# EAGLE design sduino (EAGLE 7.4.0)
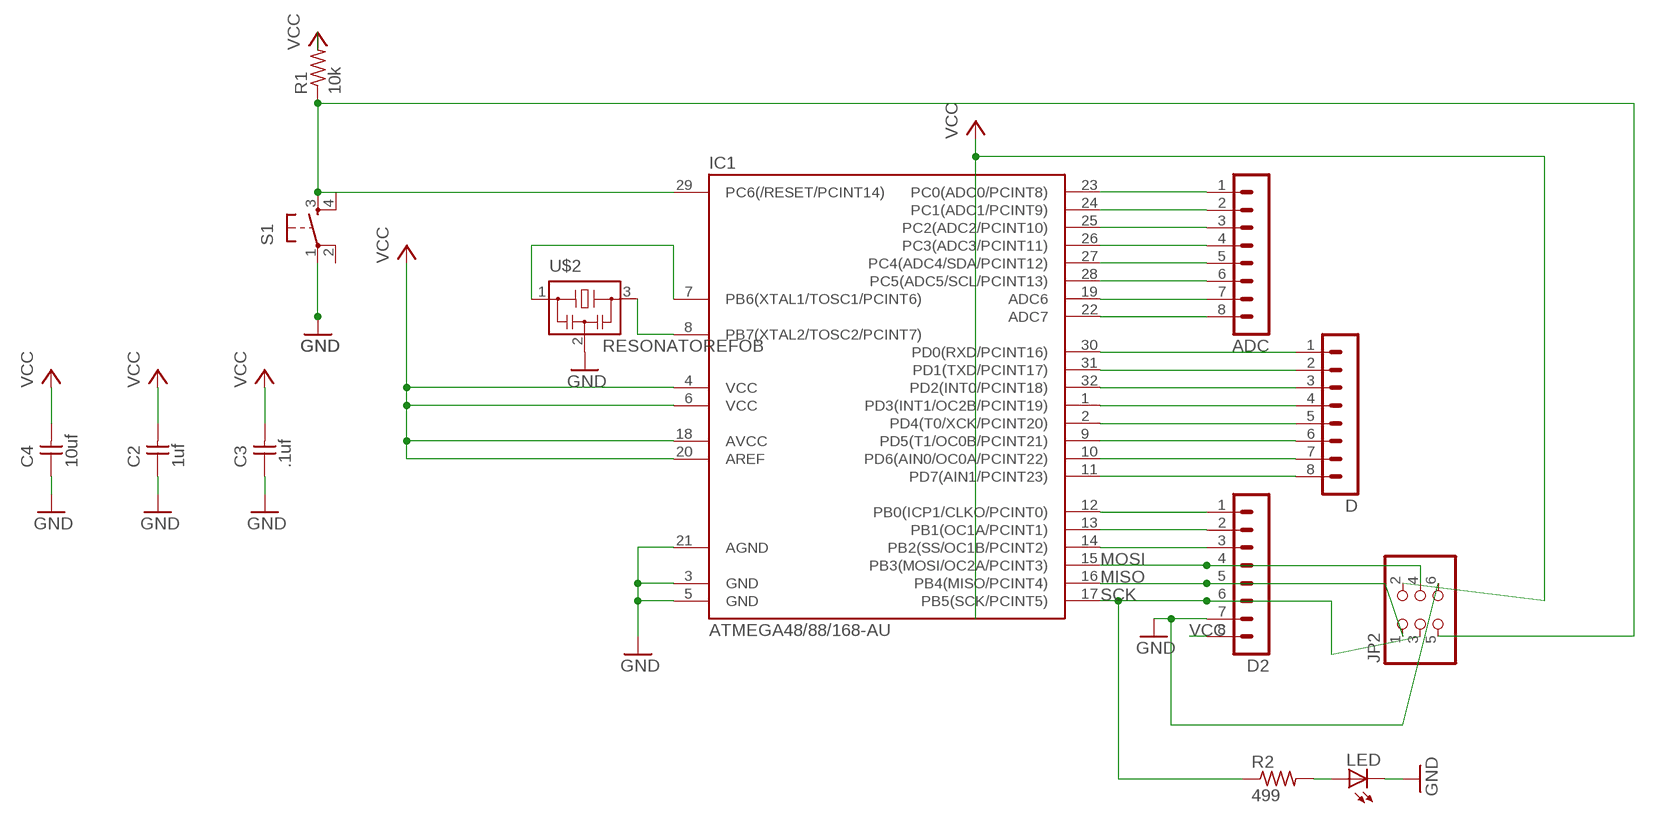
[diagram p0: schematic, sheet 1]

## Parts
ADC  MA08-1  [MA08-1]
C2  1uf  UNPOLARIZED_CAPACITOR1206  [1206]
C3  .1uf  UNPOLARIZED_CAPACITOR1206  [1206]
C4  10uf  UNPOLARIZED_CAPACITOR1206  [1206]
D  MA08-1  [MA08-1]
D2  MA08-1  [MA08-1]
IC1  ATMEGA48/88/168-AU  [TQFP32-08]
JP2  PINHD-2X3-SMD  [2X03SMD]
LED  LED1206  [1206]
R1  10k  RESISTOR1206  [1206]
R2  499  RESISTOR1206  [1206]
S1  6MM_SWITCH6MM_SWITCH  [6MM_SWITCH]
U$2  RESONATOREFOB  [EFOBM]

## Nets
GND: C2.1 C3.1 C4.1 D2.7 IC1.3(GND) IC1.5(GND) IC1.21(AGND) JP2.6 LED.2(C) S1.1(P) U$2.2
MISO: D2.5 IC1.16(PB4(MISO/PCINT4)) JP2.1
MOSI: D2.4 IC1.15(PB3(MOSI/OC2A/PCINT3)) JP2.4
N$1: IC1.7(PB6(XTAL1/TOSC1/PCINT6)) U$2.1
N$2: D2.1 IC1.12(PB0(ICP1/CLKO/PCINT0))
N$3: ADC.1 IC1.23(PC0(ADC0/PCINT8))
N$4: ADC.2 IC1.24(PC1(ADC1/PCINT9))
N$5: ADC.3 IC1.25(PC2(ADC2/PCINT10))
N$6: ADC.4 IC1.26(PC3(ADC3/PCINT11))
N$7: ADC.5 IC1.27(PC4(ADC4/SDA/PCINT12))
N$8: ADC.6 IC1.28(PC5(ADC5/SCL/PCINT13))
N$10: D.3 IC1.32(PD2(INT0/PCINT18))
N$11: D.4 IC1.1(PD3(INT1/OC2B/PCINT19))
N$12: D.5 IC1.2(PD4(T0/XCK/PCINT20))
N$13: D.6 IC1.9(PD5(T1/OC0B/PCINT21))
N$14: D.7 IC1.10(PD6(AIN0/OC0A/PCINT22))
N$15: D.8 IC1.11(PD7(AIN1/PCINT23))
N$16: IC1.8(PB7(XTAL2/TOSC2/PCINT7)) U$2.3
N$17: D2.2 IC1.13(PB1(OC1A/PCINT1))
N$18: D2.3 IC1.14(PB2(SS/OC1B/PCINT2))
N$21: ADC.7 IC1.19(ADC6)
N$22: ADC.8 IC1.22(ADC7)
N$23: LED.1(A) R2.2
RST: IC1.29(PC6(/RESET/PCINT14)) JP2.5 R1.1 S1.3(S)
RX: D.1 IC1.30(PD0(RXD/PCINT16))
SCK: D2.6 IC1.17(PB5(SCK/PCINT5)) JP2.3 R2.1
TX: D.2 IC1.31(PD1(TXD/PCINT17))
VCC: C2.2 C3.2 C4.2 D2.8 IC1.4(VCC) IC1.6(VCC) IC1.18(AVCC) IC1.20(AREF) JP2.2 R1.2
Unconnected: S1.2(P1) S1.4(S1)

## Library data of the parts
ADC D D2 = con-lstb:MA08-1: PIN HEADER
C2-C4 = ng:UNPOLARIZED_CAPACITOR: unpolarized_capacitor
IC1 = atmega8:ATMEGA48/88/168
JP2 = fab:PINHD-2X3-SMD: PIN HEADER
LED = ng:LED
R1 R2 = ng:RESISTOR
S1 = ng:6MM_SWITCH: OMRON SWITCH
U$2 = fab:RESONATOR

## Board
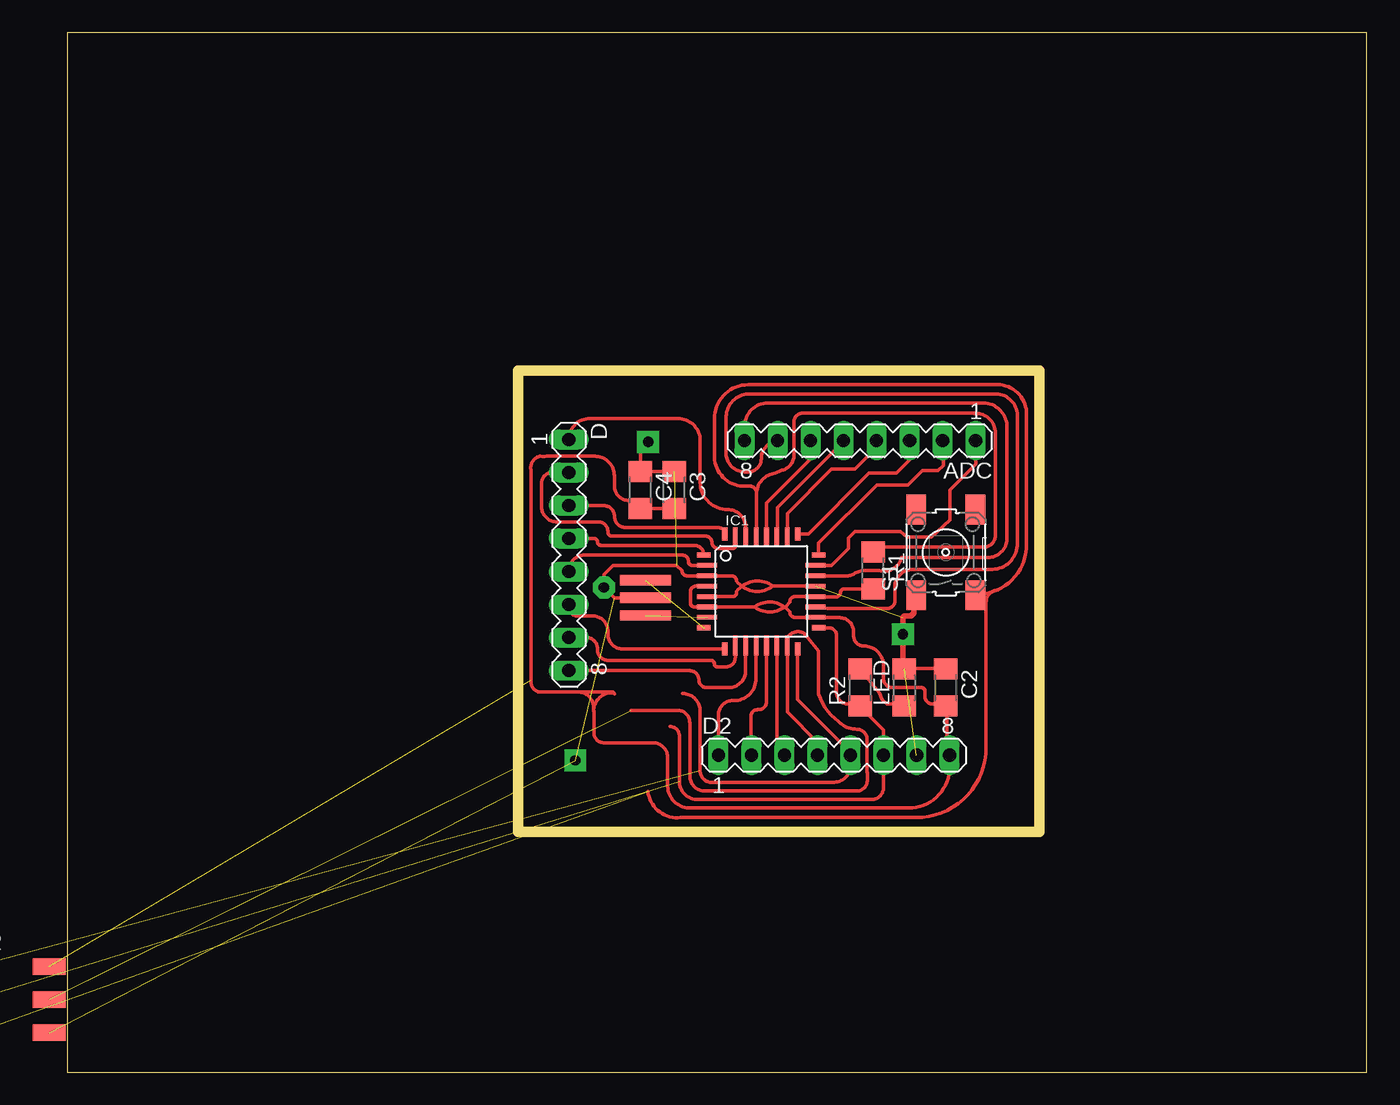
[diagram p1: board, top side]
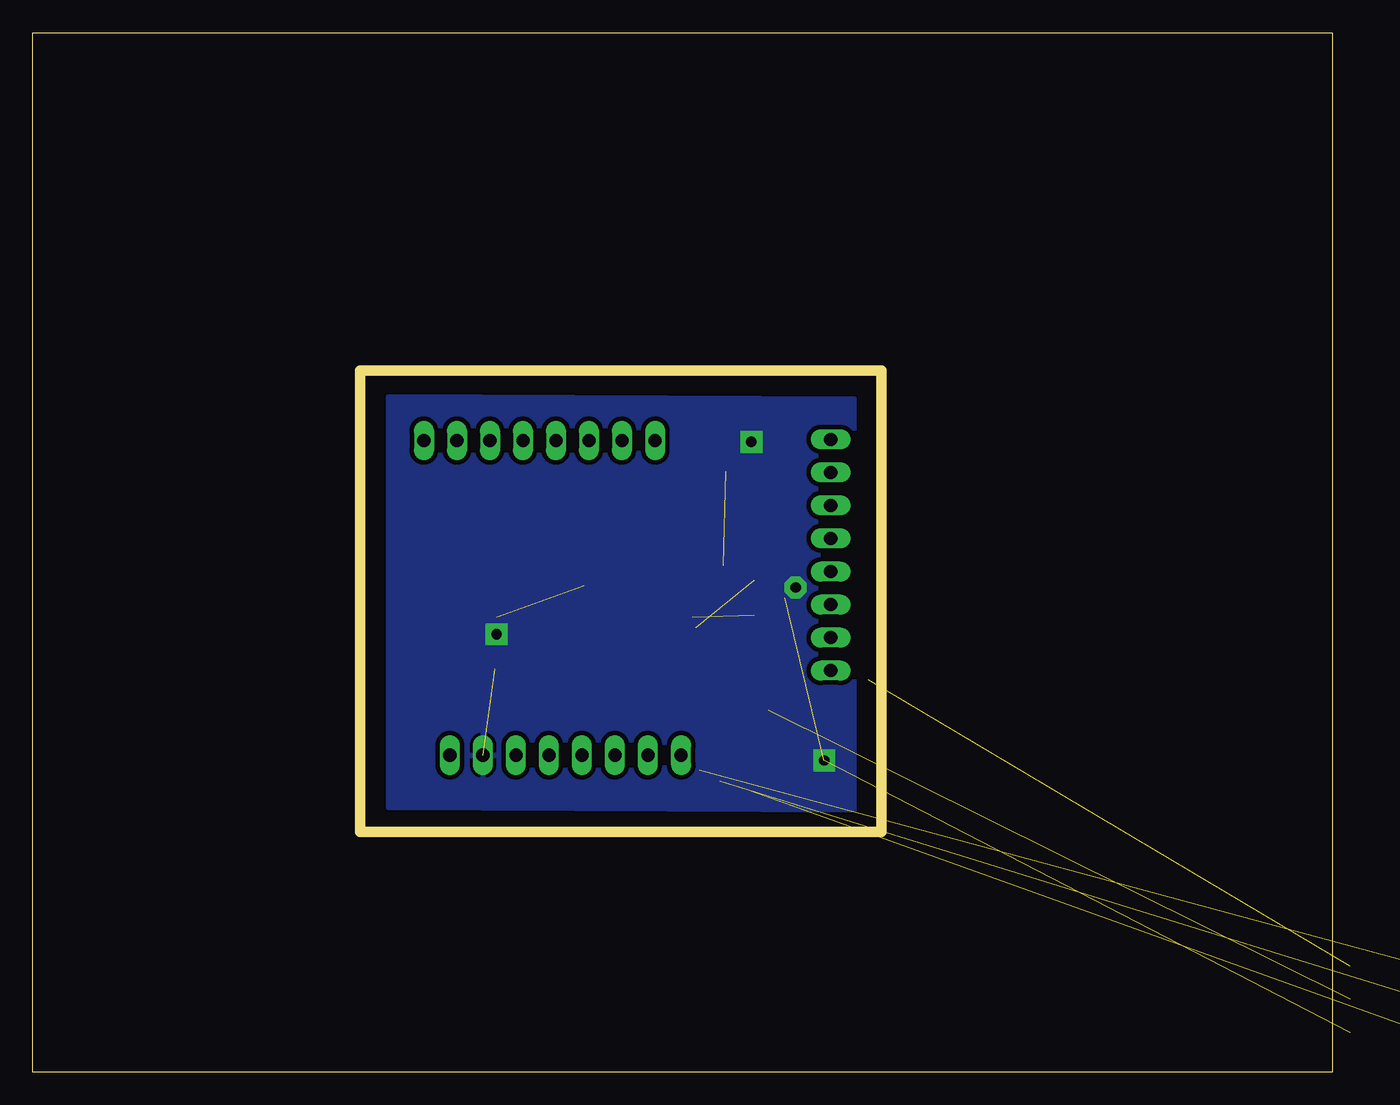
[diagram p2: board, bottom side, seen from below]

Size 100 x 80 mm. Coordinates in mm from the lower left corner, seen from the top.
Outline: 0,0 100,0 100,80 0,80 0,0
Copper layers (1*16): Top 0.035mm / dielectric 1.5mm / Bottom 0.035mm
Design rules "default *": minimum track width 10mil, minimum drill 24mil, track to track 14mil, track to pad 14mil, pad to pad 14mil, via to via 14mil, smd to smd 8mil, copper to edge 40mil, drill to drill 8mil, minimum pad ring 10mil, minimum via ring 8mil, stop-mask expansion 4mil, vias tented up to drill 0mil, thermal gap 10mil
Milling: 4 lines

### Footprints (pad centres in the part's own frame; a part is rotated, then mirrored left to right if it is on the bottom)
MA08-1 = drill 1.016 long: 1 -8.89,0; 2 -6.35,0; 3 -3.81,0; 4 -1.27,0; 5 1.27,0; 6 3.81,0; 7 6.35,0; 8 8.89,0
1206 = smd 1.6 x 1.803: 1 -1.422,0; 2 1.422,0
TQFP32-08 = smd 1.016 x 0.406: 1 -4.42,2.8; 8 -4.42,-2.8; 17 4.42,-2.8; 24 4.42,2.8 | smd 1.524 x 0.356: 2 -4.166,2; 3 -4.166,1.2; 4 -4.166,0.4; 5 -4.166,-0.4; 6 -4.166,-1.2; 7 -4.166,-2; 18 4.166,-2; 19 4.166,-1.2; 20 4.166,-0.4; 21 4.166,0.4; 22 4.166,1.2; 23 4.166,2 | smd 0.406 x 1.016: 9 -2.8,-4.42; 16 2.8,-4.42; 25 2.8,4.42; 32 -2.8,4.42 | smd 0.356 x 1.524: 10 -2,-4.166; 11 -1.2,-4.166; 12 -0.4,-4.166; 13 0.4,-4.166; 14 1.2,-4.166; 15 2,-4.166; 26 2,4.166; 27 1.2,4.166; 28 0.4,4.166; 29 -0.4,4.166; 30 -1.2,4.166; 31 -2,4.166
2X03SMD = smd 2.54 x 1.27: 1 -2.857,2.54; 2 2.857,2.54; 3 -2.857,0; 4 2.857,0; 5 -2.857,-2.54; 6 2.857,-2.54
6MM_SWITCH = smd 2.286 x 1.524: 1 -3.302,2.286; 2 3.302,2.286; 3 -3.302,-2.286; 4 3.302,-2.286
EFOBM = smd 0.8 x 3.9: 1 -1.35,0; 2 0,0; 3 1.35,0

### Placement (x,y rotation side)
ADC  61,48.6 180 top
C2  67.6,29.6 270 top
C3  46.7,44.8 270 top
C4  44.1,44.8 270 top
D  38.6,39.8 270 top
D2  59,24.4 0 top
IC1  53.4,37 0 top
JP2  -4.25,5.6 0 top
LED  64.4,29.6 90 top
R1  62,38.6 270 top
R2  61,29.6 90 top
S1  67.6,40 90 top
U$2  44.5,36.5 90 top

### Tracks (layer width: path | path; a pad name or v marks a point on that pad's centre or on a via)
GND  (via drill 0.8 pad 1.68)  (5 unrouted)
  Top 0.254: 49.38,36.58 IC1.5 51.2,36.6 arc90 51.5,36.9 51.5,37 arc-90 54.3,37.4 | 49.38,38.18 IC1.3 | C2.1 67.44,31.09 64.47,31.09 LED.2 64.24,31.09 | 65.15,36.58 S1.1 | v44.7,48.5 44.1,47.9 C4.1 C3.1 | IC1.21 54.3,37.4 | 54.3,37.4 arc-90 51.5,37.8 arc90 51.1,38.2 IC1.3 | U$2.2 42.1,36.5 41.8,36.8 arc-90 v41.3,37.3 41.3,38.3 42,39 46.9,39 47.3,38.6 arc90 47.7,38.2 IC1.3
  Top 0.406: 65.15,36.58 65.15,35.35 64.9,35.1 64.4,35.1 64.3,35 v64.3,33.7 64.3,31.12 LED.2
  other vias: 39.1,24
  pour Bottom: 36.8,51.8 72.6,52 72.6,20.4 36.8,20.2
MISO  (1 unrouted)
  Top 0.254: 56.24,32.46 IC1.16 56.2,28.7 60.27,24.63 D2.5 arc-90 60.3,24.37 60.3,23.7 arc-90 58.9,22.3 49.61,22.3 arc-90 48.7,23.21 48.7,27.8 arc90 47.36,29.14
MOSI  (1 unrouted)
  Top 0.254: 57.73,25.47 57.73,25.4 | 57.73,25.4 D2.4 | 57.73,25.4 55.4,27.73 IC1.15 55.32,32.91 55.32,33.12 arc-90 56.3,33.9 arc-62 57,33.4 57.8,32.4 57.8,29.1 arc35 59.35,27 arc48 60.75,26.4 arc-90 61.54,25.61 61.54,23.09 arc-90 61.55,23.08 61.55,22.4 arc-90 60.75,21.65 49.05,21.65 arc-90 47.9,22.8 47.9,26.9 arc90 46.95,27.85 43.38,27.85
N$1  (1 unrouted)
N$2
  Top 0.254: IC1.12 53,30.3 arc-90 51.3,28.6 51.2,28.6 arc90 50.1,27.5 D2.1 arc90 D2.1
N$3
  Top 0.254: IC1.23 58.8,39 60.1,40.3 60.1,41.1 60.6,41.6 64.1,41.6 64.6,41.2 66.5,41.2 67.9,42.5 67.9,44.8 69.9,46.8 ADC.1
N$4
  Top 0.254: IC1.24 57.82,40.72 62.3,45.2 64.7,45.2 65.8,46.3 67,46.3 67.4,46.7 67.4,48.55 ADC.2
N$5
  Top 0.254: IC1.25 57.02,41.42 61.7,46.1 63.8,46.1 64.8,47.1 ADC.3
N$6
  Top 0.254: IC1.26 55.4,43 58.8,46.4 60.6,46.4 61.8,47.6 61.8,48.13 ADC.4
N$7
  Top 0.254: IC1.27 54.63,41.38 54.63,43.43 59.66,48.46 ADC.5
N$8
  Top 0.254: IC1.28 53.8,43.8 57.2,47.2 ADC.6
N$10
  Top 0.254: 50.52,41.6 IC1.32 arc90 50.12,41.9 43,41.9 arc-90 42.1,42.8 arc90 41.3,43.6 40.3,43.6 40.29,43.61 D.3
N$11
  Top 0.254: 48.92,39.78 IC1.1 arc90 48.23,40.55 41.05,40.55 arc-90 40.8,40.8 arc90 40.53,41.07 D.4
N$12
  Top 0.254: D.5 38.63,38.63 arc-90 39.8,39.8 47.3,39.8 arc-90 47.8,39.3 arc90 48.1,39 IC1.2
N$13
  Top 0.254: D.6 arc90 39.2,35.1 40.5,35.1 arc-90 41.6,33.9 41.6,33.7 arc90 42.72,32.58 IC1.9
N$14
  Top 0.254: D.7 39.95,33.45 arc-90 40.8,32.6 40.8,32.5 arc90 41.6,31.7 49.5,31.7 arc-90 49.8,31.4 arc90 50,31.2 50.7,31.2 arc90 51.4,31.9 IC1.10
N$15
  Top 0.254: D.8 arc90 D.8 47.9,30.9 arc-90 48.6,30.2 arc90 49.2,29.6 50.9,29.6 arc90 52.2,30.9 IC1.11
N$16  (1 unrouted)
N$17
  Top 0.254: IC1.13 53.8,28.5 arc-90 53.2,27.9 53.1,27.9 arc90 52.6,27.4 52.6,24.45 arc90 D2.2
N$18
  Top 0.254: IC1.14 54.6,24.99 arc90 D2.3
N$21
  Top 0.254: IC1.19 58.5,35.7 63.09,35.69 arc90 63.7,36.3 63.7,37.6 arc-73 65,38.7 71.2,38.7 arc90 73.1,40.7 73.1,50.4 arc90 71.5,52.2 52.4,52.2 arc90 50.7,50.3 50.7,47.6 arc90 52.1,46.2 52.4,46.2 arc90 53.4,47.2 arc-84 ADC.7 54.63,48.46
N$22
  Top 0.254: 57.61,38.18 IC1.22 59.8,38.2 arc44 60.6,38.4 arc-37 61.6,38.6 62.5,38.6 arc90 64.2,39.6 70.7,39.6 arc90 72.3,41 72.3,49.6 arc90 70.5,51.5 53.9,51.5 arc90 52.1,49.6 ADC.8 arc90 ADC.8 52.12,48.69
N$23
  Top 0.254: LED.1 64.24,28.35 63.05,28.35 62.7,28.7 62.5,29.2 R2.2 61.04,30.86
RST  (1 unrouted)
  Top 0.254: 53.03,44.58 53.03,41.38 IC1.29 | 62.18,40.23 R1.1 arc-90 62.18,40.4 70.4,40.4 arc90 71.4,41.2 71.4,49.2 arc90 69.9,50.7 69.8,50.7 arc90 69.78,50.72 56.62,50.72 arc90 55.9,50 55.9,47.3 arc-72 54.9,46.3 54.5,46.1 arc78 53.03,44.63 53.03,44.58 | 53.03,44.58 arc90 52.51,45.1 52.2,45.1 arc-90 49.8,47.3 49.8,50.3 arc-90 52.4,52.9 71.8,52.9 arc-90 73.8,50.4 73.8,40.7 arc-90 70.2,36.8 69.95,36.8 S1.3 arc-90 70.7,35.88 | 44.67,21.63 arc90 47.2,19.6 65.3,19.6 arc90 70.7,25 70.7,35.88 | 70.7,35.88 70.7,36.2 arc-90 71.6,37.1
RX
  Top 0.254: D.1 arc-90 40.21,50.3 47,50.3 arc-90 48.7,48.6 48.7,45.4 arc90 50.8,43.3 arc-90 52.2,41.9 IC1.30
SCK  (1 unrouted)
  Top 0.254: 62.64,24.46 D2.6 | 46.4,26.6 arc-90 47.1,25.9 47.1,22.4 arc90 48.51,20.99 61.89,20.99 arc90 62.8,21.9 D2.6 arc-90 D2.6 | IC1.17 58.6,34.2 arc-90 59.2,33.6 59.2,29.2 arc90 60.05,28.35 60.81,28.35 R2.1 61.04,28.12 62.81,26.34 D2.6
TX
  Top 0.254: 51.44,40.92 51.44,41.15 IC1.31 51.4,40.5 arc-90 51.2,40.3 50.1,40.3 arc-90 49.6,40.8 arc90 49.1,41.25 41.9,41.25 arc-90 41.6,41.6 arc90 40.9,42.35 37.6,42.35 arc-90 36.5,43.6 36.5,45.2 arc-90 37.25,46.15 D.2
VCC  (1 unrouted)
  Top 0.254: 44.12,42.75 C4.2 | 42.01,29.26 39.3,29.26 | 39.3,29.26 36.32,29.26 arc-90 35.7,30.18 35.7,46.3 arc-95 36.4,47.4 arc11 36.9,47.4 40.6,47.4 arc-90 42.1,45.9 42.1,45.1 arc90 43.2,44 43.6,44 arc-90 44.1,43.5 C4.2 | 43.89,42.98 C4.2 | 57.38,34.98 IC1.18 | 57.38,36.58 IC1.20 | 61.95,37.03 R1.2 61.52,37.18 arc-90 61.5,37.2 59.8,37.2 arc90 59.5,36.9 arc-69 59.18,36.58 58.29,36.58 arc90 58.27,36.6 IC1.20 | 57.61,36.58 IC1.20 | IC1.18 57.61,34.98 59.44,34.98 arc-90 60.5,33.91 60.5,33.6 arc90 61.3,32.8 arc-90 62.8,31.3 62.8,30.3 arc90 63.5,29.6 65.7,29.6 arc-90 66,29.3 66,28.87 arc90 66.52,28.35 67.44,28.35 C2.2 67.67,28.12 67.67,24.46 D2.8 arc-90 D2.8 67.9,23.5 arc-90 64.73,20.33 47.97,20.33 arc-90 46.2,22 46.2,24.2 arc90 45.1,25.35 41.3,25.35 arc-90 40.52,26.13 40.52,27.78 arc90 40.5,27.8 | C4.2 C3.2 | IC1.4 48.4,37.4 arc90 47.95,37 47.95,36.1 arc90 48.3,35.8 IC1.6 52.9,35.8 | IC1.20 56,36.6 arc90 55.6,36.2 arc-90 52.9,35.8 | IC1.18 56,35 arc-90 55.6,35.4 arc90 52.9,35.8 | 40.5,27.8 40.5,28.06 arc90 39.3,29.26 | 40.5,27.8 arc-90 41.9,29.2 42,29.2 arc-90 42.1,29.1